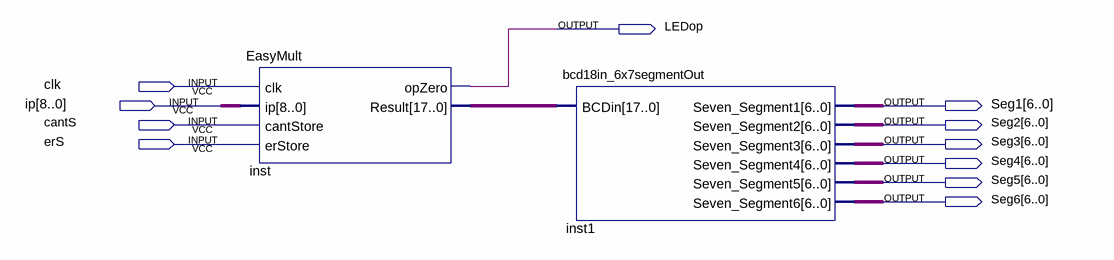
[diagram p0: schematic sheet]
// Quartus schematic mult_seg.bdf as structural Verilog: 2 symbols, 11 pins
module mult_seg (
  input  clk,
  input  [8:0] ip,
  input  cantS,
  input  erS,
  output LEDop,
  output [6:0] Seg1,
  output [6:0] Seg2,
  output [6:0] Seg3,
  output [6:0] Seg4,
  output [6:0] Seg5,
  output [6:0] Seg6
);

  wire [17:0] inst_result;

  EasyMult inst (.clk(clk), .ip(ip), .cantStore(cantS), .erStore(erS), .opZero(LEDop), .Result(inst_result));
  bcd18in_6x7segmentOut inst1 (
    .BCDin(inst_result), .Seven_Segment1(Seg1), .Seven_Segment2(Seg2), .Seven_Segment3(Seg3),
    .Seven_Segment4(Seg4), .Seven_Segment5(Seg5), .Seven_Segment6(Seg6));
endmodule
